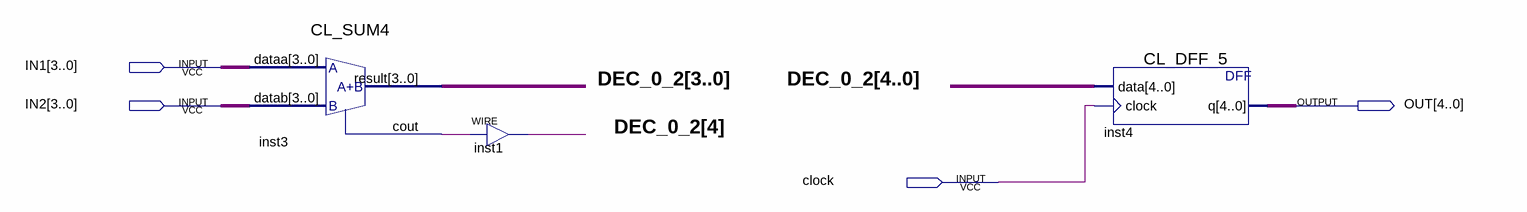
[diagram p0: schematic sheet]
// Quartus schematic CL_SUM4_BL.bdf as structural Verilog: 3 symbols, 4 pins
module CL_SUM4_BL (
  input  [3:0] IN1,
  input  [3:0] IN2,
  input  clock,
  output [4:0] OUT
);

  wire inst3_cout;
  wire [4:0] DEC_0_2;

  CL_SUM4 inst3 (.dataa(IN1), .datab(IN2), .result(DEC_0_2[3:0]), .cout(inst3_cout));
  assign DEC_0_2[4] = inst3_cout;  // WIRE inst1
  CL_DFF_5 inst4 (.data(DEC_0_2), .clock(clock), .q(OUT));
endmodule
